# EAGLE design SparkFun-OpenPIR-NCS36000 (EAGLE 7.7.0)
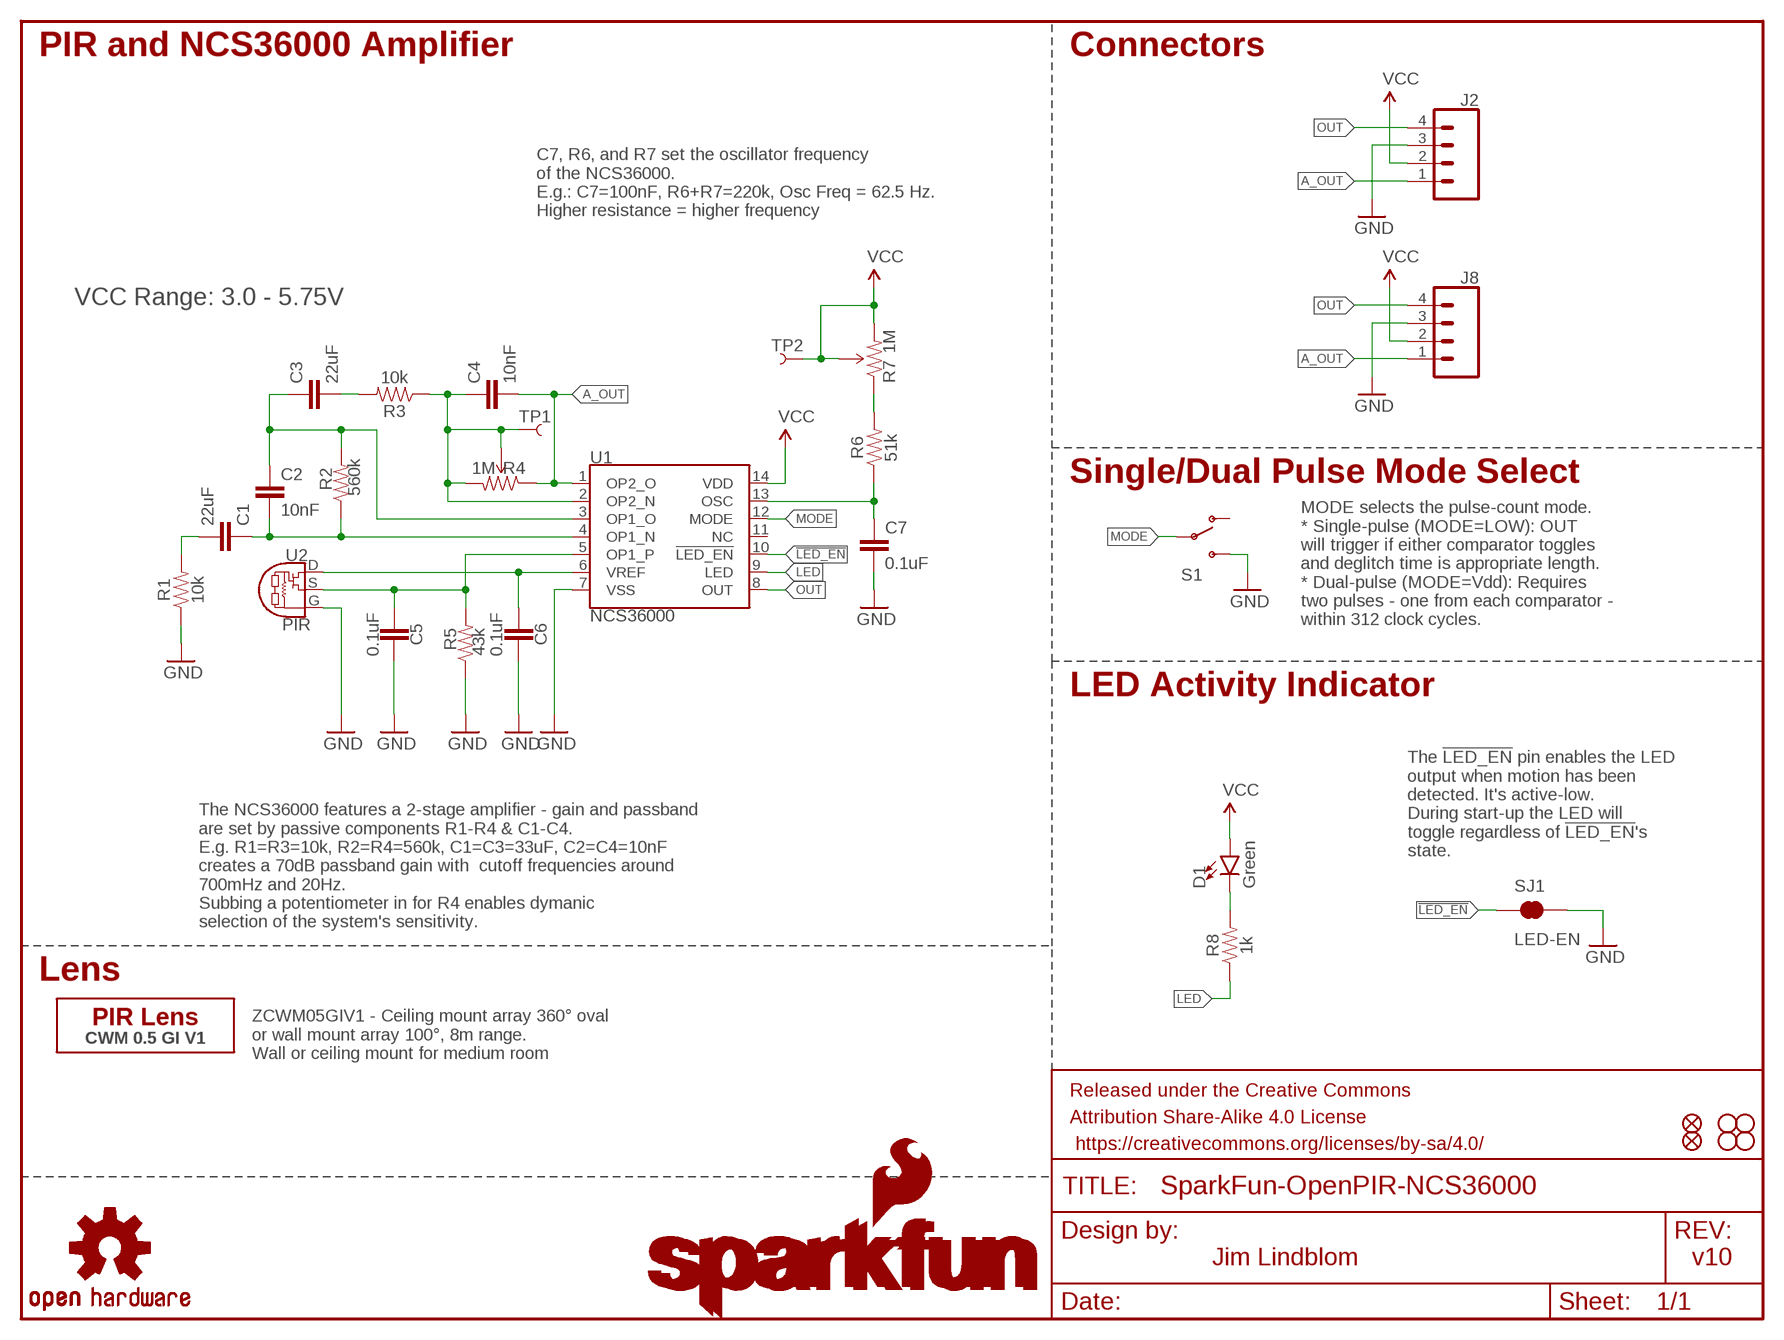
[diagram p0: schematic, sheet 1]

## Parts
C1  22uF  22UF-0805-6.3V-20%  [0805]
C2  10nF  10NF-0603-50V-10%  [0603]
C3  22uF  22UF-0805-6.3V-20%  [0805]
C4  10nF  10NF-0603-50V-10%  [0603]
C5  0.1uF  0.1UF-0603-25V-(+80/-20%)  [0603]
C6  0.1uF  0.1UF-0603-25V-(+80/-20%)  [0603]
C7  0.1uF  0.1UF-0603-25V-(+80/-20%)  [0603]
D1  Green  LED-GREEN1206-BOTTOM  [LED-1206-BOTTOM]
FD1  FIDUCIALUFIDUCIAL  [MICRO-FIDUCIAL]
FD2  FIDUCIALUFIDUCIAL  [MICRO-FIDUCIAL]
FRAME1  FRAME-LETTER  [CREATIVE_COMMONS]
H1  STAND-OFF  [STAND-OFF]
H2  STAND-OFF  [STAND-OFF]
H3  STAND-OFF  [STAND-OFF]
H4  STAND-OFF  [STAND-OFF]
J2  CONN_04JST-PTH-VERT-NS  [JST-4-PTH-VERT-NS]
J8  CONN_04NO_SILK_ALL_ROUND  [1X04_NO_SILK_ALL_ROUND]
LOGO1  SFE_LOGO_NAME_FLAME.1_INCH  [SFE_LOGO_NAME_FLAME_.1]
LOGO3  SFE_LOGO_NAME.1_INCH  [SFE_LOGO_NAME_.1]
LOGO4  OSHW-LOGOS  [OSHW-LOGO-S]
R1  10k  10KOHM-0603-1/10W-1%  [0603]
R2  560k  560KOHM-0603-1/10W-5%  [0603]
R3  10k  10KOHM-0603-1/10W-1%  [0603]
R4  1M  TRIMPOTTX33X-1M  [TRIMPOT-TC33X]
R5  43k  43KOHM-0603-1/10W-1%  [0603]
R6  51k  51KOHM-0603-1/10W-1%  [0603]
R7  1M  TRIMPOTTX33X-1M  [TRIMPOT-TC33X]
R8  1k  1KOHM-0603-1/10W-1%  [0603]
S1  SWITCH-SPDT-SMD-A  [SWITCH-SPST-SMD-A]
SJ1  LED-EN  SOLDERJUMPERNC  [SJ_2S]
TP1  TEST-POINT3X5  [PAD.03X.05]
TP2  TEST-POINT3X5  [PAD.03X.05]
U1  NCS36000  [SO14]
U2  PIR  [PIR]
U$1  CWM 0.5 GI V1  PIR-LENSCWM-0.5-GI-V1  [LENS-CWM-0.5-GI-V1]

## Nets
!LED_EN!: SJ1.1 U1.10(!LED_EN!)
A_OUT: C4.2 J2.1 J8.1 R4.1(CCW) U1.1(OP2_O)
GND: C5.2 C6.2 C7.2 J2.3 J8.3 R1.1 R5.1 S1.3(S) SJ1.2 U1.7(VSS) U2.G
LED: R8.1 U1.9(LED)
MODE: S1.2(P) U1.12(MODE)
N$1: C5.1 R5.2 U1.5(OP1_P) U2.S
N$2: C6.1 U1.6(VREF) U2.D
N$3: C1.2 R1.2
N$4: C3.2 R3.2
N$5: C1.1 C2.2 R2.1 U1.4(OP1_N)
N$6: C2.1 C3.1 R2.2 U1.3(OP1_O)
N$7: C4.1 R3.1 R4.2(WIPER) R4.3(CW) TP1.P$1 U1.2(OP2_N)
N$8: C7.1 R6.1 U1.13(OSC)
N$9: D1.C R8.2
N$11: R6.2 R7.1(CCW)
OUT: J2.4 J8.4 U1.8(OUT)
VCC: D1.A J2.2 J8.2 R7.2(WIPER) R7.3(CW) TP2.P$1 U1.14(VDD)
Unconnected: S1.1(O) U1.11(NC)

## Notes on the sheet
- PIR and NCS36000 Amplifier | Connectors
- C7, R6, and R7 set the oscillator frequency 
  of the NCS36000.
  E.g.: C7=100nF, R6+R7=220k, Osc Freq = 62.5 Hz.
  Higher resistance = higher frequency
- VCC Range: 3.0 - 5.75V
- Single/Dual Pulse Mode Select
- MODE selects the pulse-count mode.
  * Single-pulse (MODE=LOW): OUT 
  will trigger if either comparator toggles
  and deglitch time is appropriate length.
  * Dual-pulse (MODE=Vdd): Requires 
  two pulses - one from each comparator -
  within 312 clock cycles.
- LED Activity Indicator
- The !LED_EN! pin enables the LED 
  output when motion has been 
  detected. It's active-low.
  During start-up the LED will 
  toggle regardless of !LED_EN!'s 
  state.
- The NCS36000 features a 2-stage amplifier - gain and passband 
  are set by passive components R1-R4 & C1-C4.
  E.g. R1=R3=10k, R2=R4=560k, C1=C3=33uF, C2=C4=10nF 
  creates a 70dB passband gain with  cutoff frequencies around 
  700mHz and 20Hz.
  Subbing a potentiometer in for R4 enables dymanic
  selection of the system's sensitivity.
- Lens
- ZCWM05GIV1 - Ceiling mount array 360° oval
  or wall mount array 100°, 8m range.
  Wall or ceiling mount for medium room
- Jim Lindblom | v10

## Library data of the parts
C1 C3 = SparkFun-Capacitors:22UF: 22µF ceramic capacitors A capacitor is a passive two-terminal electrical component used to store electrical energy temporarily in an electric field.; PROD_ID: CAP-08402
C2 C4 = SparkFun-Capacitors:10NF: 0.01uF/10nF/10,000pF ceramic capacitors A capacitor is a passive two-terminal electrical component used to store electrical energy temporarily in an electric field. CAP-09321; PROD_ID: CAP-00867
C5-C7 = SparkFun-Capacitors:0.1UF: 0.1µF ceramic capacitors A capacitor is a passive two-terminal electrical component used to store electrical energy temporarily in an electric field.; PROD_ID: CAP-00810
D1 = SparkFun-LED:LED-GREEN: Green SMD LED Used in manufacturing of various products at SparkFun Packages: 0603 - SMD 0603 package [Product Link] <http://www.futureelectronics.com/en/technologies/semiconductors/optoelectronics/leds/Pages/9894312-LTST-C190GKT.aspx?CrossPart=HSMG-C190&IM=0> LilyPad 1206 - SMD1206 LilyPad package [Product Link] <http://www.futureelectronics.com/en/Technologies/Product.aspx?ProductID=IN150NGHARVATEKCORPORATION2049943&IM=0> 1206 - SMD1206 package [Product Link] <http://www.futureelectronics.com/en/technologies/semiconductors/optoelectronics/leds/Pages/8315665-LTST-C150KGKT.aspx?IM=0> 1206 Bottom Mount -SMD 1206 Bottom Mount [Product Link] <http://www.digikey.com/product-detail/en/lite-on-inc/LTST-C230KGKT/160-1456-1-ND/386854> SparkFun Products: Pro Mini 328 -5V <https://www.sparkfun.com/products/821> RedBoard <https://www.sparkfun.com/products/12757> MP3 Trigger <https://www.sparkfun.com/products/13720> Makey Makey <https://www.sparkfun.com/products/11076>; PROD_ID: DIO-11076
FD1 FD2 = SparkFun-Aesthetics:FIDUCIAL: Fiducial Alignment Points Various fiducial points for machine vision alignment.
FRAME1 = SparkFun-Aesthetics:FRAME-LETTER: Schematic Frame Standard 8.5x11 US Letter frame
H1-H4 = SparkFun-Electromechanical:STAND-OFF: #4 Stand Off This is the mechanical footprint for a #4 phillips button head screw. Use the keepout ring to avoid running the screw head into surrounding components. SKU : PRT-00447
J2 = openPIR-temp:CONN_04: Header 4 Standard 4-pin 0.1" header. Use with straight break away headers (SKU : PRT-00116), right angle break away headers (PRT-00553), swiss pins (PRT-00743), machine pins (PRT-00117), and female headers (PRT-00115). Molex polarized connector foot print use with SKU : PRT-08231 with associated crimp pins and housings. 1MM SMD Version SKU: PRT-10208
J8 = SparkFun-Connectors:CONN_04: Header 4 Standard 4-pin 0.1" header. Use with straight break away headers (SKU : PRT-00116), right angle break away headers (PRT-00553), swiss pins (PRT-00743), machine pins (PRT-00117), and female headers (PRT-00115). Molex polarized connector foot print use with SKU : PRT-08231 with associated crimp pins and housings. 1MM SMD Version SKU: PRT-10208; PROD_ID: CONN-09696
LOGO1 = SparkFun-Aesthetics:SFE_LOGO_NAME_FLAME: SparkFun Font Logo w/ Flame This is the SparkFun full logo. The logo on the schematic will always be the same size; the package variant is the height of the flame part of the logo. Default layer for the logo on the board is tSilk.
LOGO3 = SparkFun-Aesthetics:SFE_LOGO_NAME: SFE Logo, name only This is the SparkFun name logo. The logo on the schematic will always be the same size; the package variant is the height of the flame part of the logo (or the height the flame would be, if it were drawn). Default layer for the logo on the board is tSilk.
LOGO4 = SparkFun-Aesthetics:OSHW-LOGO: Open Source Hardware Logo This logo indicates the piece of hardware it is found on incorporates a OSHW license and/or adheres to the definition of open source hardware found here: http://freedomdefined.org/OSHW
R1 R3 = SparkFun-Resistors:10KOHM: 10kΩ resistor A resistor is a passive two-terminal electrical component that implements electrical resistance as a circuit element. Resistors act to reduce current flow, and, at the same time, act to lower voltage levels within circuits.; PROD_ID: RES-00824
R2 = openPIR-temp:560KOHM: 560kΩ resistor A resistor is a passive two-terminal electrical component that implements electrical resistance as a circuit element. Resistors act to reduce current flow, and, at the same time, act to lower voltage levels within circuits.; PROD_ID: RES-10301
R4 R7 = openPIR-temp:TRIMPOT: Various small potentiometers for "set-and-forget" applications; PROD_ID: RES-13431
R5 = SparkFun-Resistors:43KOHM: 43kΩ resistor A resistor is a passive two-terminal electrical component that implements electrical resistance as a circuit element. Resistors act to reduce current flow, and, at the same time, act to lower voltage levels within circuits.; PROD_ID: RES-07858
R6 = openPIR-temp:51KOHM: 51kΩ resistor A resistor is a passive two-terminal electrical component that implements electrical resistance as a circuit element. Resistors act to reduce current flow, and, at the same time, act to lower voltage levels within circuits.; PROD_ID: RES-08495
R8 = SparkFun-Resistors:1KOHM: 1kΩ resistor A resistor is a passive two-terminal electrical component that implements electrical resistance as a circuit element. Resistors act to reduce current flow, and, at the same time, act to lower voltage levels within circuits.; PROD_ID: RES-07856
S1 = SparkFun-Electromechanical:SWITCH-SPDT: SPDT Switch Simple slide switch, Spark Fun Electronics SKU : COM-00102 DPDT SMT slide switch, AYZ0202, SWCH-08179; PROD_ID: SWCH-10651
SJ1 = SparkFun-Retired:SOLDERJUMPER: Solder Jumper Standard SMD solder jumper. Used to automate production. Two varients : Normally Open and Normally Closed are the same, but have different paste layers. NC will have a large amount of paste and should jumper during reflow.
TP1 TP2 = SparkFun-Connectors:TEST-POINT: Bare copper test points for troubleshooting or ICT
U1 = openPIR-temp:NCS36000; PROD_ID: IC-13432
U2 = openPIR-temp:PIR; PROD_ID: IC-13430
U$1 = openPIR-temp:PIR-LENS

## Board
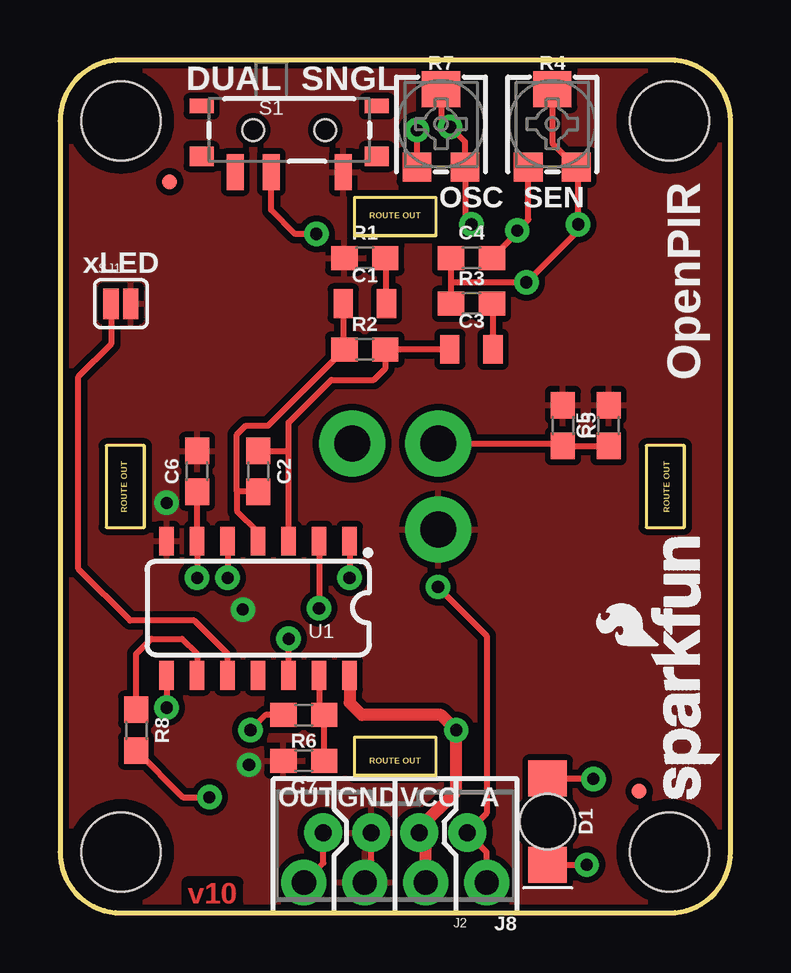
[diagram p1: board, top side]
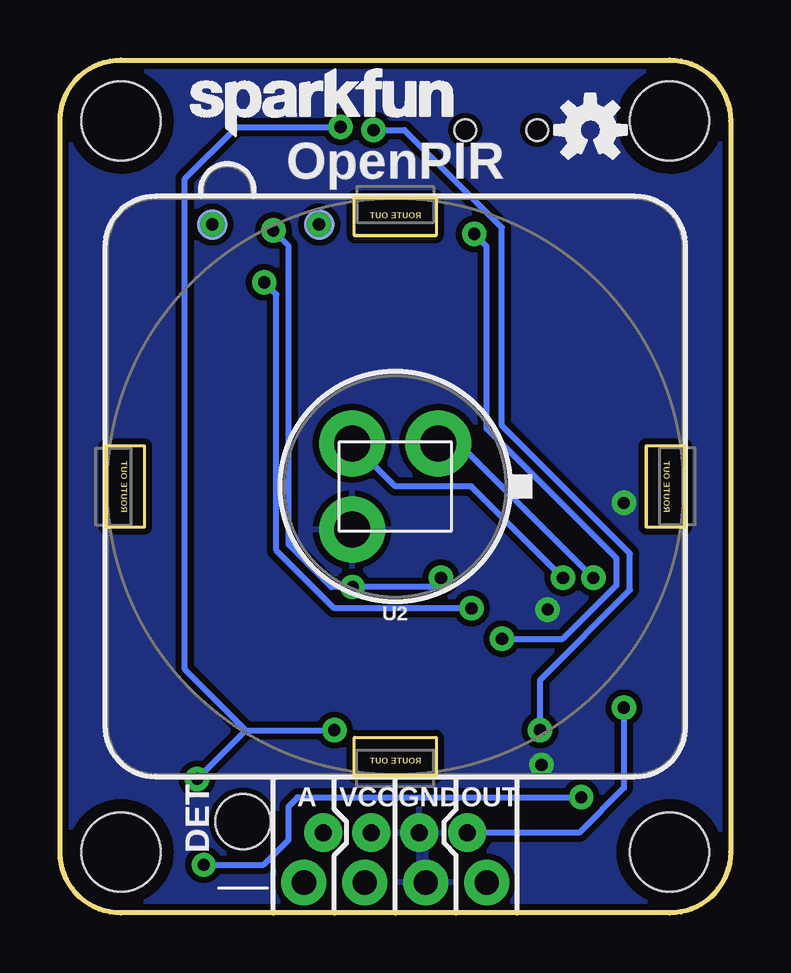
[diagram p2: board, bottom side, seen from below]

Size 27.94 x 35.56 mm. Coordinates in mm from the lower left corner, seen from the top.
Outline: 0,2.54 arc90 2.54,0 25.4,0 arc90 27.94,2.54 27.94,33.02 arc90 25.4,35.56 2.54,35.56 arc90 0,33.02 0,2.54
Copper layers (1*16): Top 0.035mm / dielectric 1.5mm / Bottom 0.035mm
Design rules "SparkFun-2-layer-STANDARD": minimum track width 10mil, minimum drill 20mil, track to track 10mil, track to pad 8mil, pad to pad 8mil, via to via 10mil, smd to smd 8mil, copper to edge 8mil, drill to drill 8mil, minimum pad ring 10mil, minimum via ring 10mil, stop-mask expansion 4mil, vias tented up to drill 25mil, thermal gap 10mil

### Footprints (pad centres in the part's own frame; a part is rotated, then mirrored left to right if it is on the bottom)
0805 = smd 0.8 x 1.2: 1 -0.9,0; 2 0.9,0
0603 = smd 1.1 x 1: 1 -0.85,0; 2 0.85,0
LED-1206-BOTTOM = smd 1.5 x 1.6: A -1.8,0; C 1.8,0 | hole 2.3: 0,0
MICRO-FIDUCIAL = smd 0.635 x 0.635: 1 0,0
STAND-OFF = hole 3.302: 0,0
JST-4-PTH-VERT-NS = drill 0.7 pad 1.6: 1 -3,-0.55; 2 -1,-0.55; 3 1,-0.55; 4 3,-0.55
1X04_NO_SILK_ALL_ROUND = drill 1.016 pad 1.88: 1 0,0; 2 2.54,0; 3 5.08,0; 4 7.62,0
TRIMPOT-TC33X = smd 1.2 x 1.2: 1 -1,-1.8; 3 1,-1.8 | smd 1.6 x 1.5: 2 0,1.45
SWITCH-SPST-SMD-A = smd 0.7 x 1.5: 1 -2.25,-1.75; 2 -0.75,-1.75; 3 2.25,-1.75 | smd 1 x 0.6: GND1 -3.65,1; GND3 3.65,1 | smd 1 x 0.8: GND2 -3.65,-1.1; GND4 3.65,-1.1 | hole 0.9: -1.5,0; 1.5,0
SJ_2S = smd 0.635 x 1.27: 1 -0.412,0; 2 0.412,0
PAD.03X.05 = smd 1.27 x 1.27: P$1 0,0
SO14 = smd 0.6 x 1.2: 1 -3.81,-2.8; 2 -2.54,-2.8; 3 -1.27,-2.8; 4 0,-2.8; 5 1.27,-2.8; 6 2.54,-2.8; 7 3.81,-2.8; 8 3.81,2.8; 9 2.54,2.8; 10 1.27,2.8; 11 0,2.8; 12 -1.27,2.8; 13 -2.54,2.8; 14 -3.81,2.8
PIR = drill 1.5 pad 2.75: D -1.8,-1.8; G 1.8,1.8; S 1.8,-1.8

### Placement (x,y rotation side)
C1  12.7,25.4 0 top
C2  8.26,18.41 270 top
C3  17.14,23.5 0 top
C4  17.14,27.3 0 top
C5  22.86,20.32 90 top
C6  5.71,18.41 90 top
C7  10.16,6.35 180 top
D1  20.32,3.81 270 top
FD1  4.57,30.48 0 top
FD2  24.13,5.08 0 top
FRAME1  -8.89,-20.32 0 top  (outside the outline)
H1  2.54,33.02 0 top
H2  25.4,33.02 0 top
H3  2.54,2.54 0 top
H4  25.4,2.54 0 top
J2  13.97,2.79 180 top
J8  17.78,1.27 180 top
LOGO1  27.56,4.32 90 top
LOGO3  22.99,31.88 0 bottom
LOGO4  5.84,32.64 0 bottom
R1  12.7,27.3 0 top
R2  12.7,23.5 0 top
R3  17.14,25.4 0 top
R4  20.51,32.89 0 top
R5  20.95,20.32 270 top
R6  10.16,8.26 180 top
R7  15.88,32.89 0 top
R8  3.17,7.62 270 top
S1  9.55,32.64 0 top
SJ1  2.54,25.4 0 top
TP1  21.59,28.7 0 bottom
TP2  17.14,28.7 0 bottom
U1  8.26,12.7 180 top
U2  13.97,17.78 180 bottom
U$1  13.97,17.78 0 bottom

### Tracks (layer width: path | path; a pad name or v marks a point on that pad's centre or on a via)
!LED_EN!
  Top 0.254: U1.10 6.99,10.79 5.59,12.19 2.92,12.19 0.76,14.35 0.76,22.35 2.13,23.72 SJ1.1
A_OUT  (via drill 0.51)
  Top 0.254: U1.1 v12.06,13.97 | J8.1 17.78,2.53 J2.1 17.78,4.15 17.78,11.56 v15.75,13.59 | 19.68,30.92 R4.1 19.51,28.91 v19.05,28.45 19.05,28.36 C4.2
  Bottom 0.254: v12.06,13.97 12.45,13.59 v15.75,13.59 16.64,13.59 18.41,15.37 18.41,27.81 v19.05,28.45
GND  (via drill 0.51)
  Top 0.254: J8.3 12.97,1.54 J2.3
  other vias: 7.87,6.17 4.45,17.09 7.62,12.65
  pour Bottom (isolate 0.254): 27.94,0 27.94,35.56 0,35.56 0,0
  pour Top (isolate 0.254): 0,0 0,35.56 27.94,35.56 27.94,0
LED
  Top 0.254: R8.1 3.17,10.79 3.81,11.43 5.08,11.43 5.71,10.79 U1.9
MODE  (via drill 0.51)
  Top 0.254: U1.12 v9.53,11.43 | S1.2 8.8,29.3 9.79,28.31 v10.68,28.31
  Bottom 0.254: v9.53,11.43 6.99,11.43 4.75,13.66 4.75,14.78 10.16,20.19 10.16,27.79 v10.68,28.31
N$1  (via drill 0.51)
  Top 0.254: U1.5 v6.99,13.97 | U2.S 20.95,19.58 R5.2 C5.1
  Bottom 0.254: v6.99,13.97 10.79,17.78 13.97,17.78 U2.S
N$2  (via drill 0.51)
  Top 0.254: v5.71,13.97 U1.6 C6.1
  Bottom 0.254: v5.71,13.97 11.32,19.58 U2.D
N$3
  Top 0.254: C1.2 13.6,27.25 R1.2
N$4
  Top 0.254: C3.2 18.05,25.35 R3.2
N$5
  Top 0.254: U1.4 8.26,15.88 7.37,16.76 7.37,17.57 | 7.37,17.57 7.37,19.94 7.75,20.32 8.68,20.32 R2.1 11.8,23.55 C1.1 | C2.2 7.37,17.57
N$6
  Top 0.254: C3.1 R2.2 13.55,22.69 13.08,22.23 11.3,22.23 9.53,20.45 9.53,19.27 | U1.3 9.53,19.27 | C2.1 9.53,19.27
N$7  (via drill 0.51)
  Top 0.254: U1.2 v10.79,12.7 | R4.2 20.51,32.09 R4.3 21.59,31.01 TP1.P$1 21.59,28.45 v19.43,26.29 16.3,26.29 | R3.1 16.3,26.29 | 16.3,26.29 C4.1
  Bottom 0.254: v10.79,12.7 16.51,12.7 18.92,15.11 18.92,25.78 v19.43,26.29
  other vias: 21.59,28.7
N$8
  Top 0.254: C7.1 R6.1 10.79,8.47 U1.13
N$9  (via drill 0.51)
  Top 0.254: D1.C v21.95,2.01 | R8.2 5.12,4.83 v6.22,4.83
  Bottom 0.254: v21.95,2.01 19.45,2.01 18.41,3.05 18.41,4.45 18.03,4.83 v6.22,4.83
N$11  (via drill 0.51)
  Top 0.254: R6.2 8.57,8.26 v7.94,7.62 | R7.1 v14.88,32.64
  Bottom 0.254: v7.94,7.62 7.94,9.72 4.19,13.46 4.19,14.99 9.53,20.32 9.53,28.57 13.59,32.64 v14.88,32.64
OUT  (via drill 0.51)
  Top 0.254: U1.8 v4.45,8.56 | J8.4 10.97,2.08 J2.4
  Bottom 0.254: v4.45,8.56 4.45,5.21 6.31,3.34 J2.4
VCC  (via drill 0.51)
  Top 0.254: R7.2 15.88,33.15 v16.26,32.77 16.88,32.15 R7.3 16.88,28.97 TP2.P$1 | v22.23,5.59 20.34,5.59 D1.A
  Top 0.508: U1.14 12.06,8.76 12.57,8.26 15.88,8.26 v16.51,7.62 16.51,5.08 14.97,3.54 J2.2 15.24,3.07 J8.2
  Bottom 0.254: v16.26,32.77 20.57,32.77 22.73,30.61 22.73,10.16 20.19,7.62 | v22.23,5.59 20.19,7.62 | 20.19,7.62 v16.51,7.62 | 16.88,28.97 TP2.P$1
  other vias: 17.14,28.7

### Text on the board
Top: v10
Dimension: ROUTE OUT | ROUTE OUT | ROUTE OUT | ROUTE OUT
tPlace: DUAL | SNGL | OSC | SEN | OpenPIR | xLED | OUT | GND | VCC | A
bPlace: OpenPIR | OUT | GND | VCC | A | DET
Measures: Units in Inches
tDocu: Jim Lindblom